# Altium schematic sheet bal2un_1.SchDoc
size A4
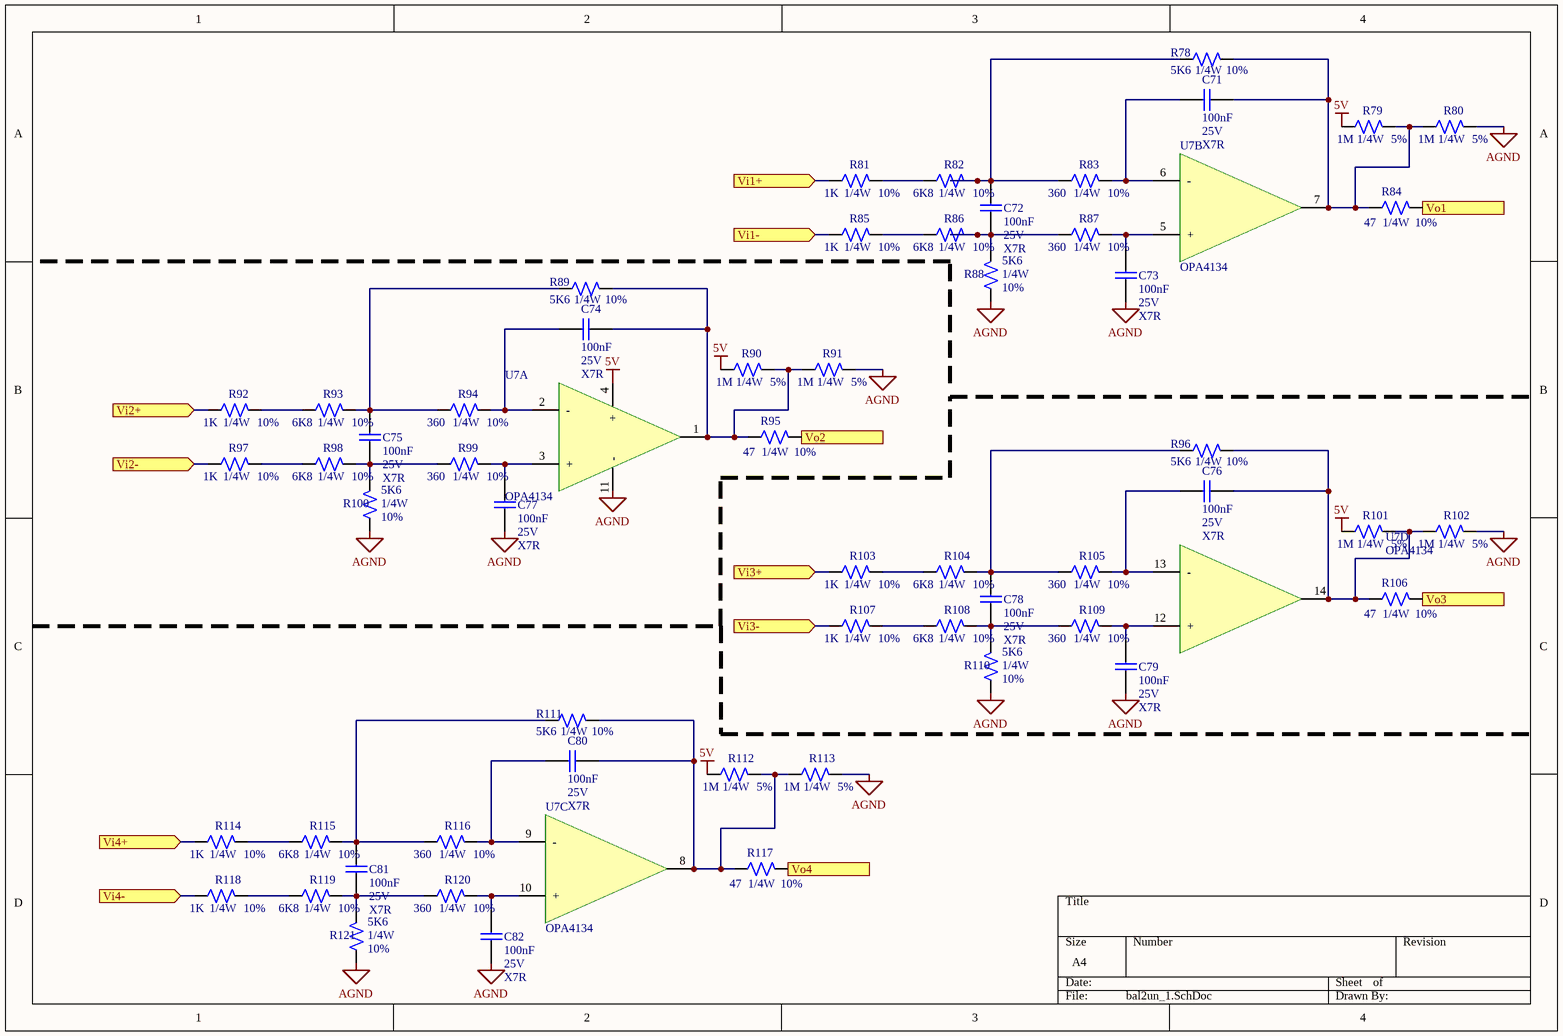
[diagram p0: bal2un_1.SchDoc]

## Parts
C71  valor: 100nF  tension: 25V  tolerancia: X7R  [C0805]  (hidden comment: Capacitor)
C72  valor: 100nF  tension: 25V  tolerancia: X7R  [C0805]  (hidden comment: Capacitor)
C73  valor: 100nF  tension: 25V  tolerancia: X7R  [C0805]  (hidden comment: Capacitor)
C74  valor: 100nF  tension: 25V  tolerancia: X7R  [C0805]  (hidden comment: Capacitor)
C75  valor: 100nF  tension: 25V  tolerancia: X7R  [C0805]  (hidden comment: Capacitor)
C76  valor: 100nF  tension: 25V  tolerancia: X7R  [C0805]  (hidden comment: Capacitor)
C77  valor: 100nF  tension: 25V  tolerancia: X7R  [C0805]  (hidden comment: Capacitor)
C78  valor: 100nF  tension: 25V  tolerancia: X7R  [C0805]  (hidden comment: Capacitor)
C79  valor: 100nF  tension: 25V  tolerancia: X7R  [C0805]  (hidden comment: Capacitor)
C80  valor: 100nF  tension: 25V  tolerancia: X7R  [C0805]  (hidden comment: Capacitor)
C81  valor: 100nF  tension: 25V  tolerancia: X7R  [C0805]  (hidden comment: Capacitor)
C82  valor: 100nF  tension: 25V  tolerancia: X7R  [C0805]  (hidden comment: Capacitor)
R78  Valor: 5K6  Potencia: 1/4W  Tolerancia: 10%  [R0805]  (hidden comment: Resistor)
R79  Valor: 1M  Potencia: 1/4W  Tolerancia: 5%  [R0805]  (hidden comment: Resistor)
R80  Valor: 1M  Potencia: 1/4W  Tolerancia: 5%  [R0805]  (hidden comment: Resistor)
R81  Valor: 1K  Potencia: 1/4W  Tolerancia: 10%  [R0805]  (hidden comment: Resistor)
R82  Valor: 6K8  Potencia: 1/4W  Tolerancia: 10%  [R0805]  (hidden comment: Resistor)
R83  Valor: 360  Potencia: 1/4W  Tolerancia: 10%  [R0805]  (hidden comment: Resistor)
R84  Valor: 47  Potencia: 1/4W  Tolerancia: 10%  [R0805]  (hidden comment: Resistor)
R85  Valor: 1K  Potencia: 1/4W  Tolerancia: 10%  [R0805]  (hidden comment: Resistor)
R86  Valor: 6K8  Potencia: 1/4W  Tolerancia: 10%  [R0805]  (hidden comment: Resistor)
R87  Valor: 360  Potencia: 1/4W  Tolerancia: 10%  [R0805]  (hidden comment: Resistor)
R88  Valor: 5K6  Potencia: 1/4W  Tolerancia: 10%  [R0805]  (hidden comment: Resistor)
R89  Valor: 5K6  Potencia: 1/4W  Tolerancia: 10%  [R0805]  (hidden comment: Resistor)
R90  Valor: 1M  Potencia: 1/4W  Tolerancia: 5%  [R0805]  (hidden comment: Resistor)
R91  Valor: 1M  Potencia: 1/4W  Tolerancia: 5%  [R0805]  (hidden comment: Resistor)
R92  Valor: 1K  Potencia: 1/4W  Tolerancia: 10%  [R0805]  (hidden comment: Resistor)
R93  Valor: 6K8  Potencia: 1/4W  Tolerancia: 10%  [R0805]  (hidden comment: Resistor)
R94  Valor: 360  Potencia: 1/4W  Tolerancia: 10%  [R0805]  (hidden comment: Resistor)
R95  Valor: 47  Potencia: 1/4W  Tolerancia: 10%  [R0805]  (hidden comment: Resistor)
R96  Valor: 5K6  Potencia: 1/4W  Tolerancia: 10%  [R0805]  (hidden comment: Resistor)
R97  Valor: 1K  Potencia: 1/4W  Tolerancia: 10%  [R0805]  (hidden comment: Resistor)
R98  Valor: 6K8  Potencia: 1/4W  Tolerancia: 10%  [R0805]  (hidden comment: Resistor)
R99  Valor: 360  Potencia: 1/4W  Tolerancia: 10%  [R0805]  (hidden comment: Resistor)
R100  Valor: 5K6  Potencia: 1/4W  Tolerancia: 10%  [R0805]  (hidden comment: Resistor)
R101  Valor: 1M  Potencia: 1/4W  Tolerancia: 5%  [R0805]  (hidden comment: Resistor)
R102  Valor: 1M  Potencia: 1/4W  Tolerancia: 5%  [R0805]  (hidden comment: Resistor)
R103  Valor: 1K  Potencia: 1/4W  Tolerancia: 10%  [R0805]  (hidden comment: Resistor)
R104  Valor: 6K8  Potencia: 1/4W  Tolerancia: 10%  [R0805]  (hidden comment: Resistor)
R105  Valor: 360  Potencia: 1/4W  Tolerancia: 10%  [R0805]  (hidden comment: Resistor)
R106  Valor: 47  Potencia: 1/4W  Tolerancia: 10%  [R0805]  (hidden comment: Resistor)
R107  Valor: 1K  Potencia: 1/4W  Tolerancia: 10%  [R0805]  (hidden comment: Resistor)
R108  Valor: 6K8  Potencia: 1/4W  Tolerancia: 10%  [R0805]  (hidden comment: Resistor)
R109  Valor: 360  Potencia: 1/4W  Tolerancia: 10%  [R0805]  (hidden comment: Resistor)
R110  Valor: 5K6  Potencia: 1/4W  Tolerancia: 10%  [R0805]  (hidden comment: Resistor)
R111  Valor: 5K6  Potencia: 1/4W  Tolerancia: 10%  [R0805]  (hidden comment: Resistor)
R112  Valor: 1M  Potencia: 1/4W  Tolerancia: 5%  [R0805]  (hidden comment: Resistor)
R113  Valor: 1M  Potencia: 1/4W  Tolerancia: 5%  [R0805]  (hidden comment: Resistor)
R114  Valor: 1K  Potencia: 1/4W  Tolerancia: 10%  [R0805]  (hidden comment: Resistor)
R115  Valor: 6K8  Potencia: 1/4W  Tolerancia: 10%  [R0805]  (hidden comment: Resistor)
R116  Valor: 360  Potencia: 1/4W  Tolerancia: 10%  [R0805]  (hidden comment: Resistor)
R117  Valor: 47  Potencia: 1/4W  Tolerancia: 10%  [R0805]  (hidden comment: Resistor)
R118  Valor: 1K  Potencia: 1/4W  Tolerancia: 10%  [R0805]  (hidden comment: Resistor)
R119  Valor: 6K8  Potencia: 1/4W  Tolerancia: 10%  [R0805]  (hidden comment: Resistor)
R120  Valor: 360  Potencia: 1/4W  Tolerancia: 10%  [R0805]  (hidden comment: Resistor)
R121  Valor: 5K6  Potencia: 1/4W  Tolerancia: 10%  [R0805]  (hidden comment: Resistor)
U7  OPA4134  [TSSOP-14]  (parts A,B,C,D of 4)

## Ports
Vi1+ (in), Vi1- (in), Vi2+ (in), Vi2- (in), Vi3+ (in), Vi3- (in), Vi4+ (in), Vi4- (in), Vo1 (out), Vo2 (out), Vo3 (out), Vo4 (out)

## Nets
5V: R79.1 R90.1 R101.1 R112.1 U7.4(+)
AGND: C73.2 C77.2 C79.2 C82.2 R80.2 R88.1 R91.2 R100.1 R102.2 R110.1 R113.2 R121.1 U7.11(-)
Vi1+: R81.1 ; port Vi1+
Vi1-: R85.1 ; port Vi1-
Vi2+: R92.1 ; port Vi2+
Vi2-: R97.1 ; port Vi2-
Vi3+: R103.1 ; port Vi3+
Vi3-: R107.1 ; port Vi3-
Vi4+: R114.1 ; port Vi4+
Vi4-: R118.1 ; port Vi4-
Vo1: R84.2 ; port Vo1
Vo2: R95.2 ; port Vo2
Vo3: R106.2 ; port Vo3
Vo4: R117.2 ; port Vo4
NetC71_1: C71.1 R78.2 R79.2 R80.1 R84.1 U7.7(OUT)
NetC71_2: C71.2 R83.2 U7.6(-)
NetC72_1: C72.1 R78.1 R82.2 R83.1
NetC72_2: C72.2 R86.2 R87.1 R88.2
NetC73_1: C73.1 R87.2 U7.5(+)
NetC74_1: C74.1 R89.2 R90.2 R91.1 R95.1 U7.1(OUT)
NetC74_2: C74.2 R94.2 U7.2(-)
NetC75_1: C75.1 R89.1 R93.2 R94.1
NetC75_2: C75.2 R98.2 R99.1 R100.2
NetC76_1: C76.1 R96.2 R101.2 R102.1 R106.1 U7.14(OUT)
NetC76_2: C76.2 R105.2 U7.13(-)
NetC77_1: C77.1 R99.2 U7.3(+)
NetC78_1: C78.1 R96.1 R104.2 R105.1
NetC78_2: C78.2 R108.2 R109.1 R110.2
NetC79_1: C79.1 R109.2 U7.12(+)
NetC80_1: C80.1 R111.2 R112.2 R113.1 R117.1 U7.8(OUT)
NetC80_2: C80.2 R116.2 U7.9(-)
NetC81_1: C81.1 R111.1 R115.2 R116.1
NetC81_2: C81.2 R119.2 R120.1 R121.2
NetC82_1: C82.1 R120.2 U7.10(+)
NetR81_2: R81.2 R82.1
NetR85_2: R85.2 R86.1
NetR92_2: R92.2 R93.1
NetR97_2: R97.2 R98.1
NetR103_2: R103.2 R104.1
NetR107_2: R107.2 R108.1
NetR114_2: R114.2 R115.1
NetR118_2: R118.2 R119.1

## Library data of the parts
C71-C82 = Capacitor: Capacitor de placas paralelas; Encapsulado: 0805
R78-R121 = Resistor: Resistencia
U7 = Opamp_x4: Integrado con 4 operacionales; Cod. Proveedor: 296-22024-1-ND; Proveedor: Digi-Key; Encapsulado: 8-SOIC; Fabricante: Texas Instruments; Link: https://www.digikey.com/product-detail/es/OPA2134UA-2K5/296-22024-1-ND/301154?utm_campaign=buynow&WT.z_cid=ref_octopart_dkc_buynow&utm_medium=aggregator&curr=usd&site=us&utm_source=octopart